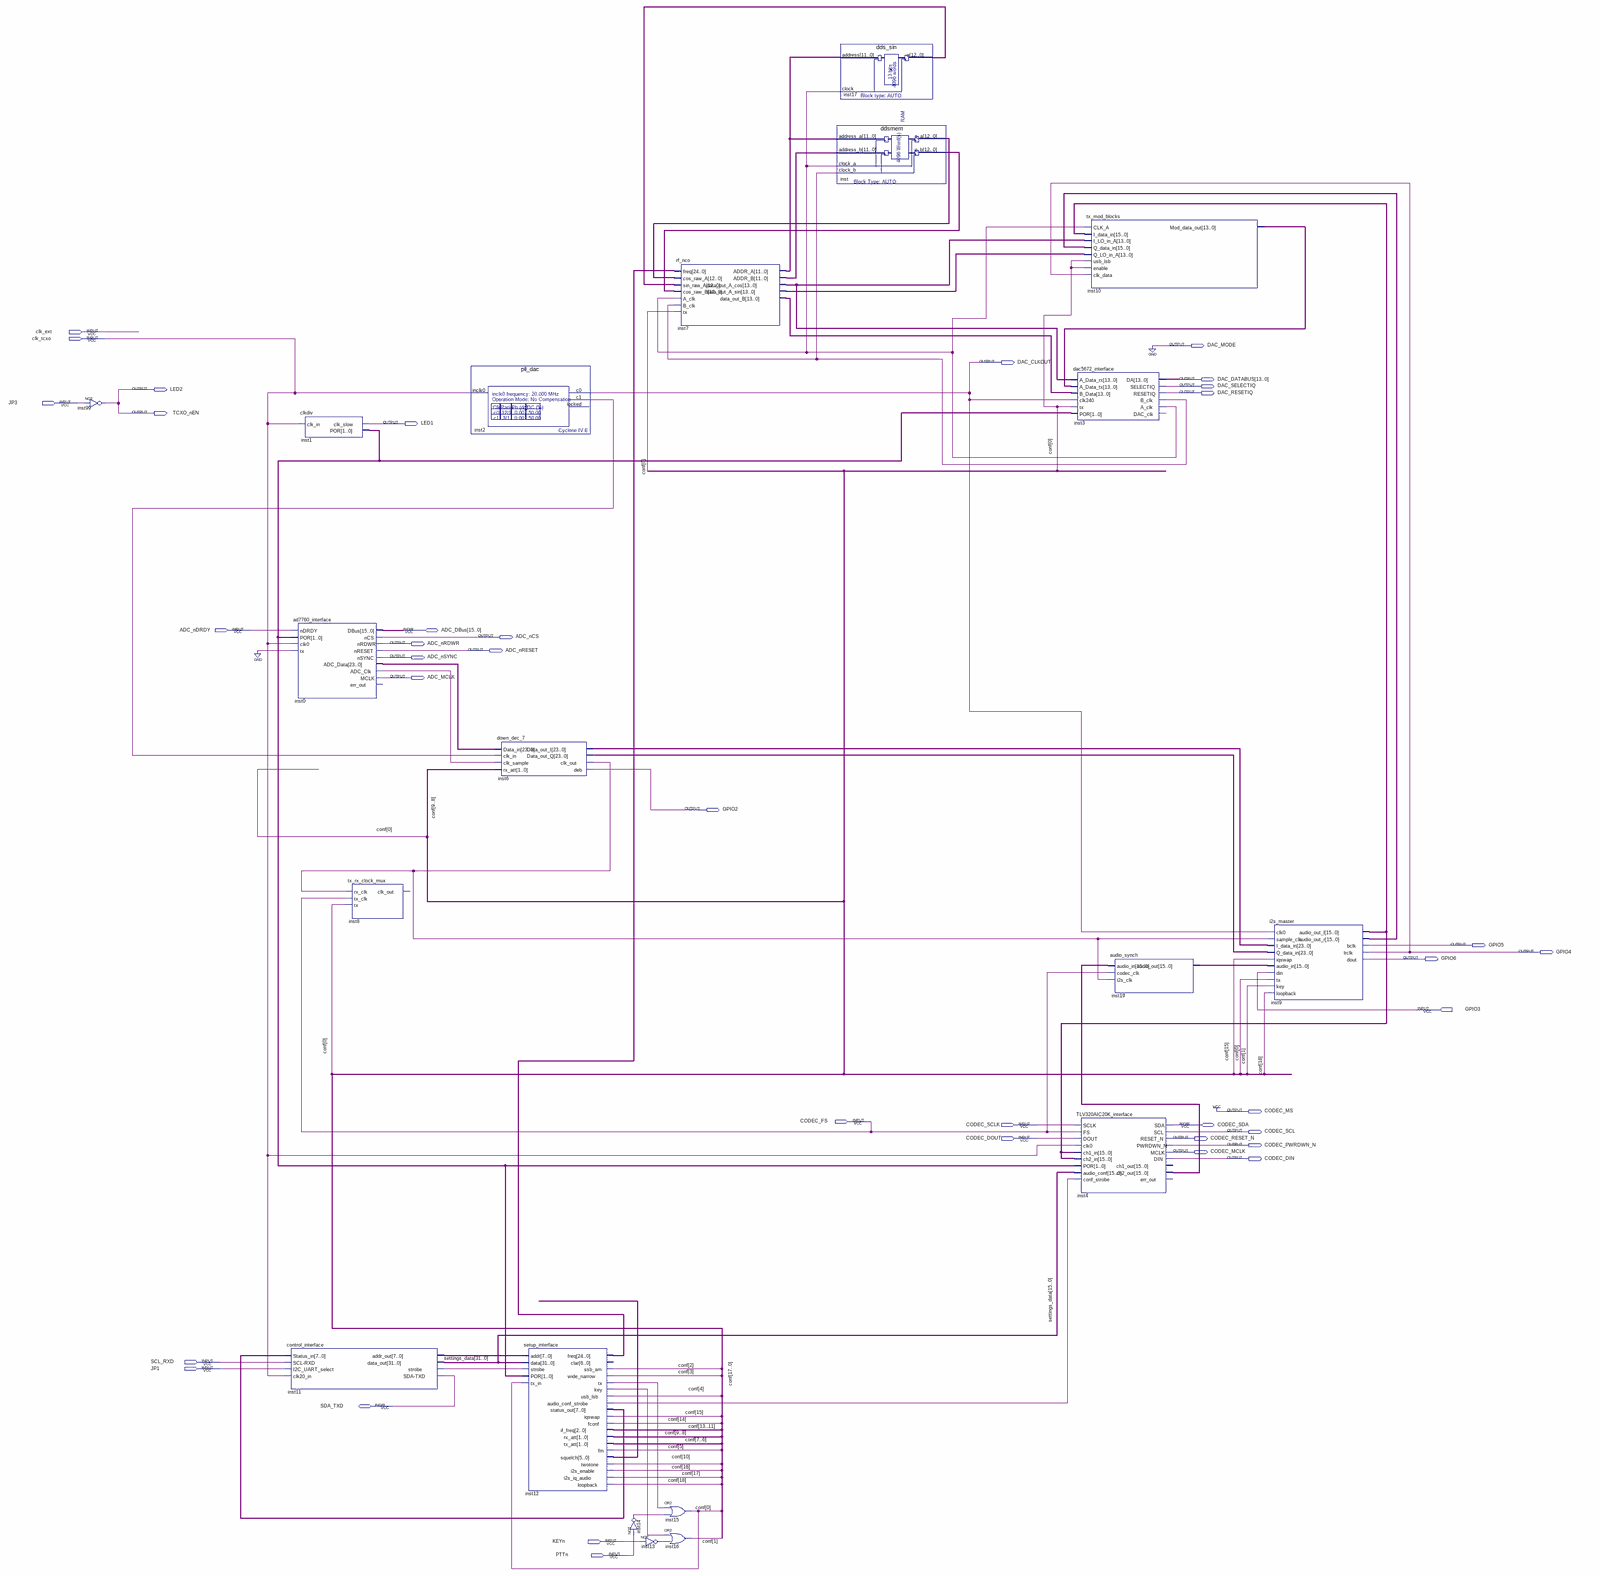
[diagram p0: schematic sheet, whole]
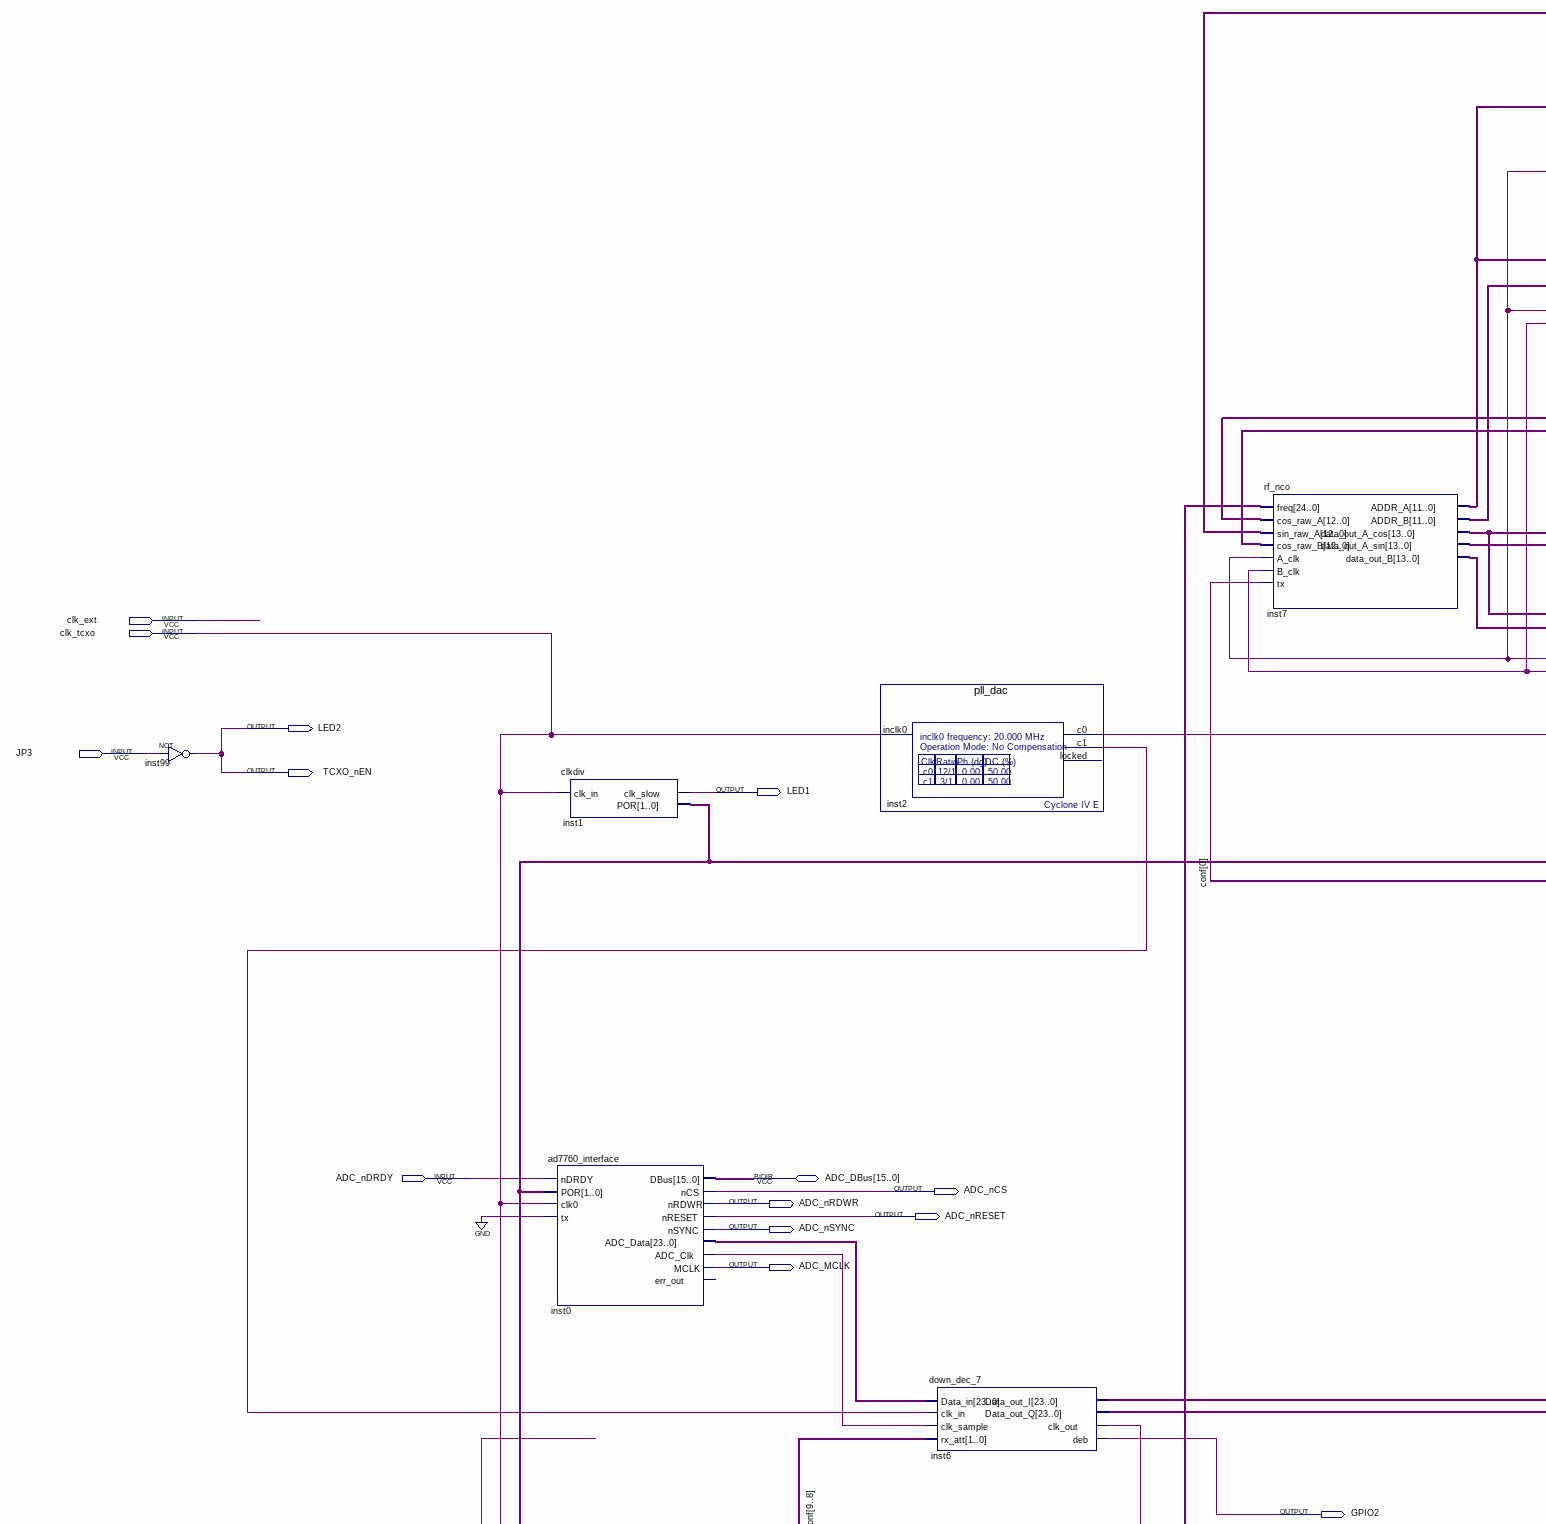
[diagram p1: schematic sheet, upper left part]
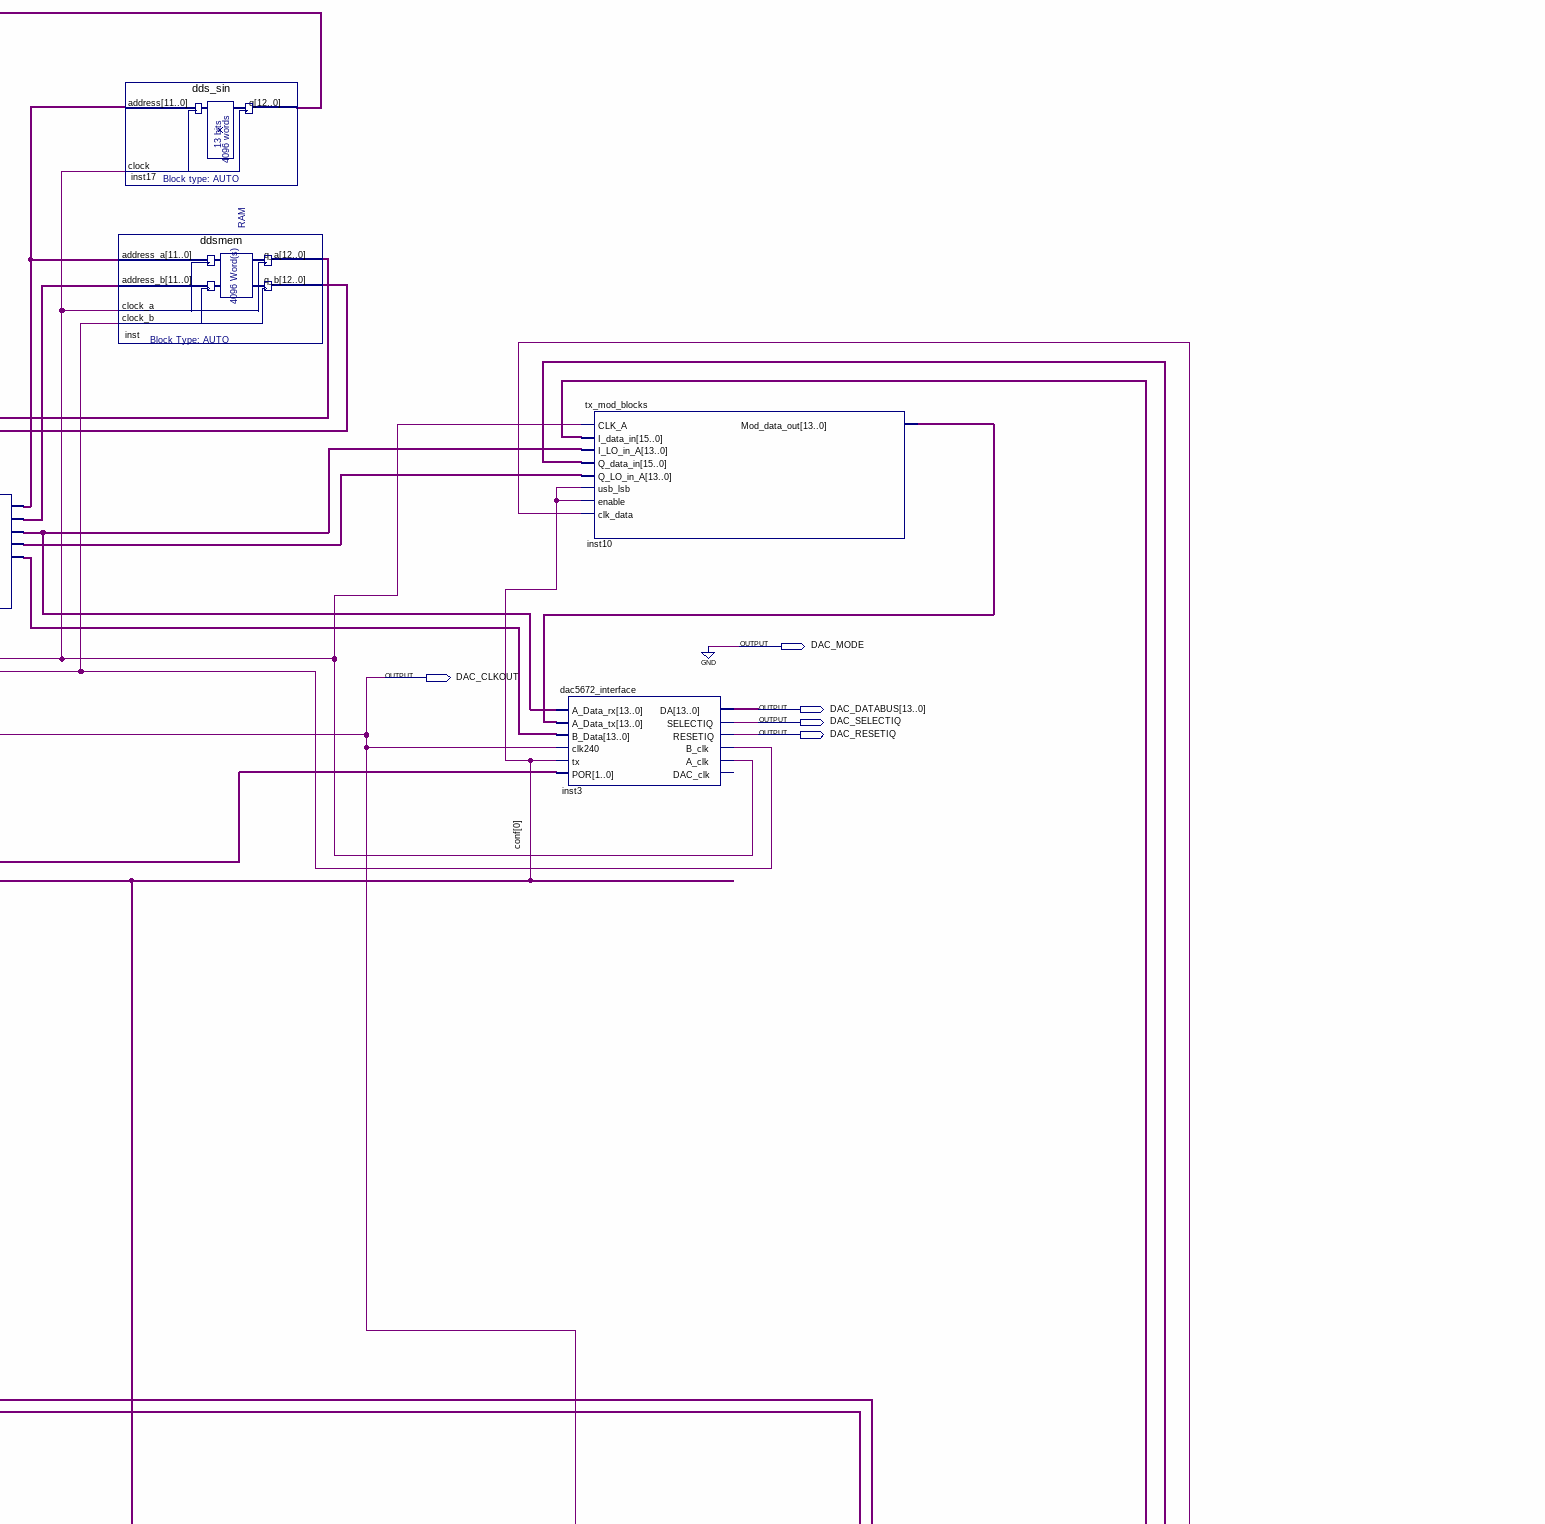
[diagram p2: schematic sheet, upper right part]
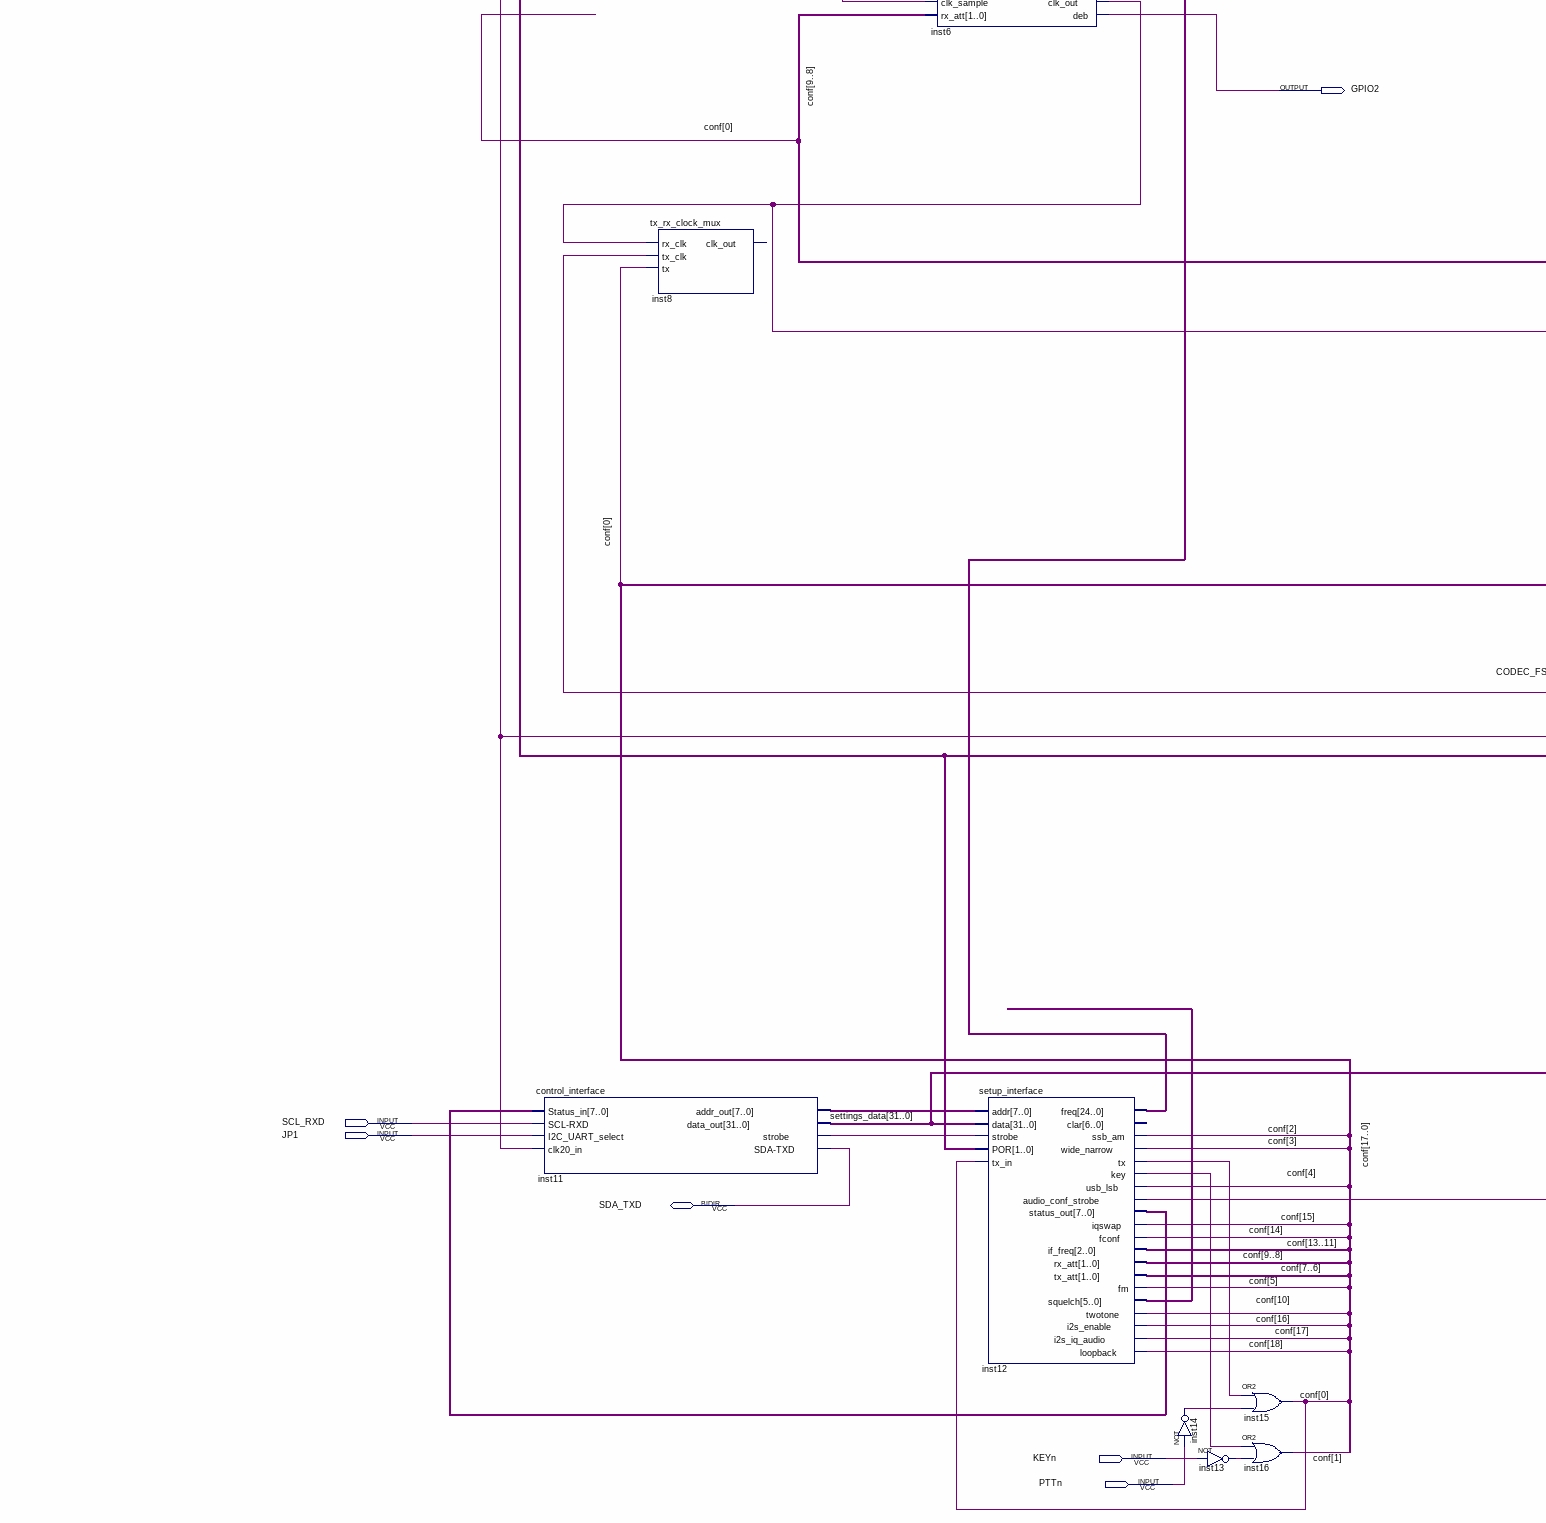
[diagram p3: schematic sheet, lower left part]
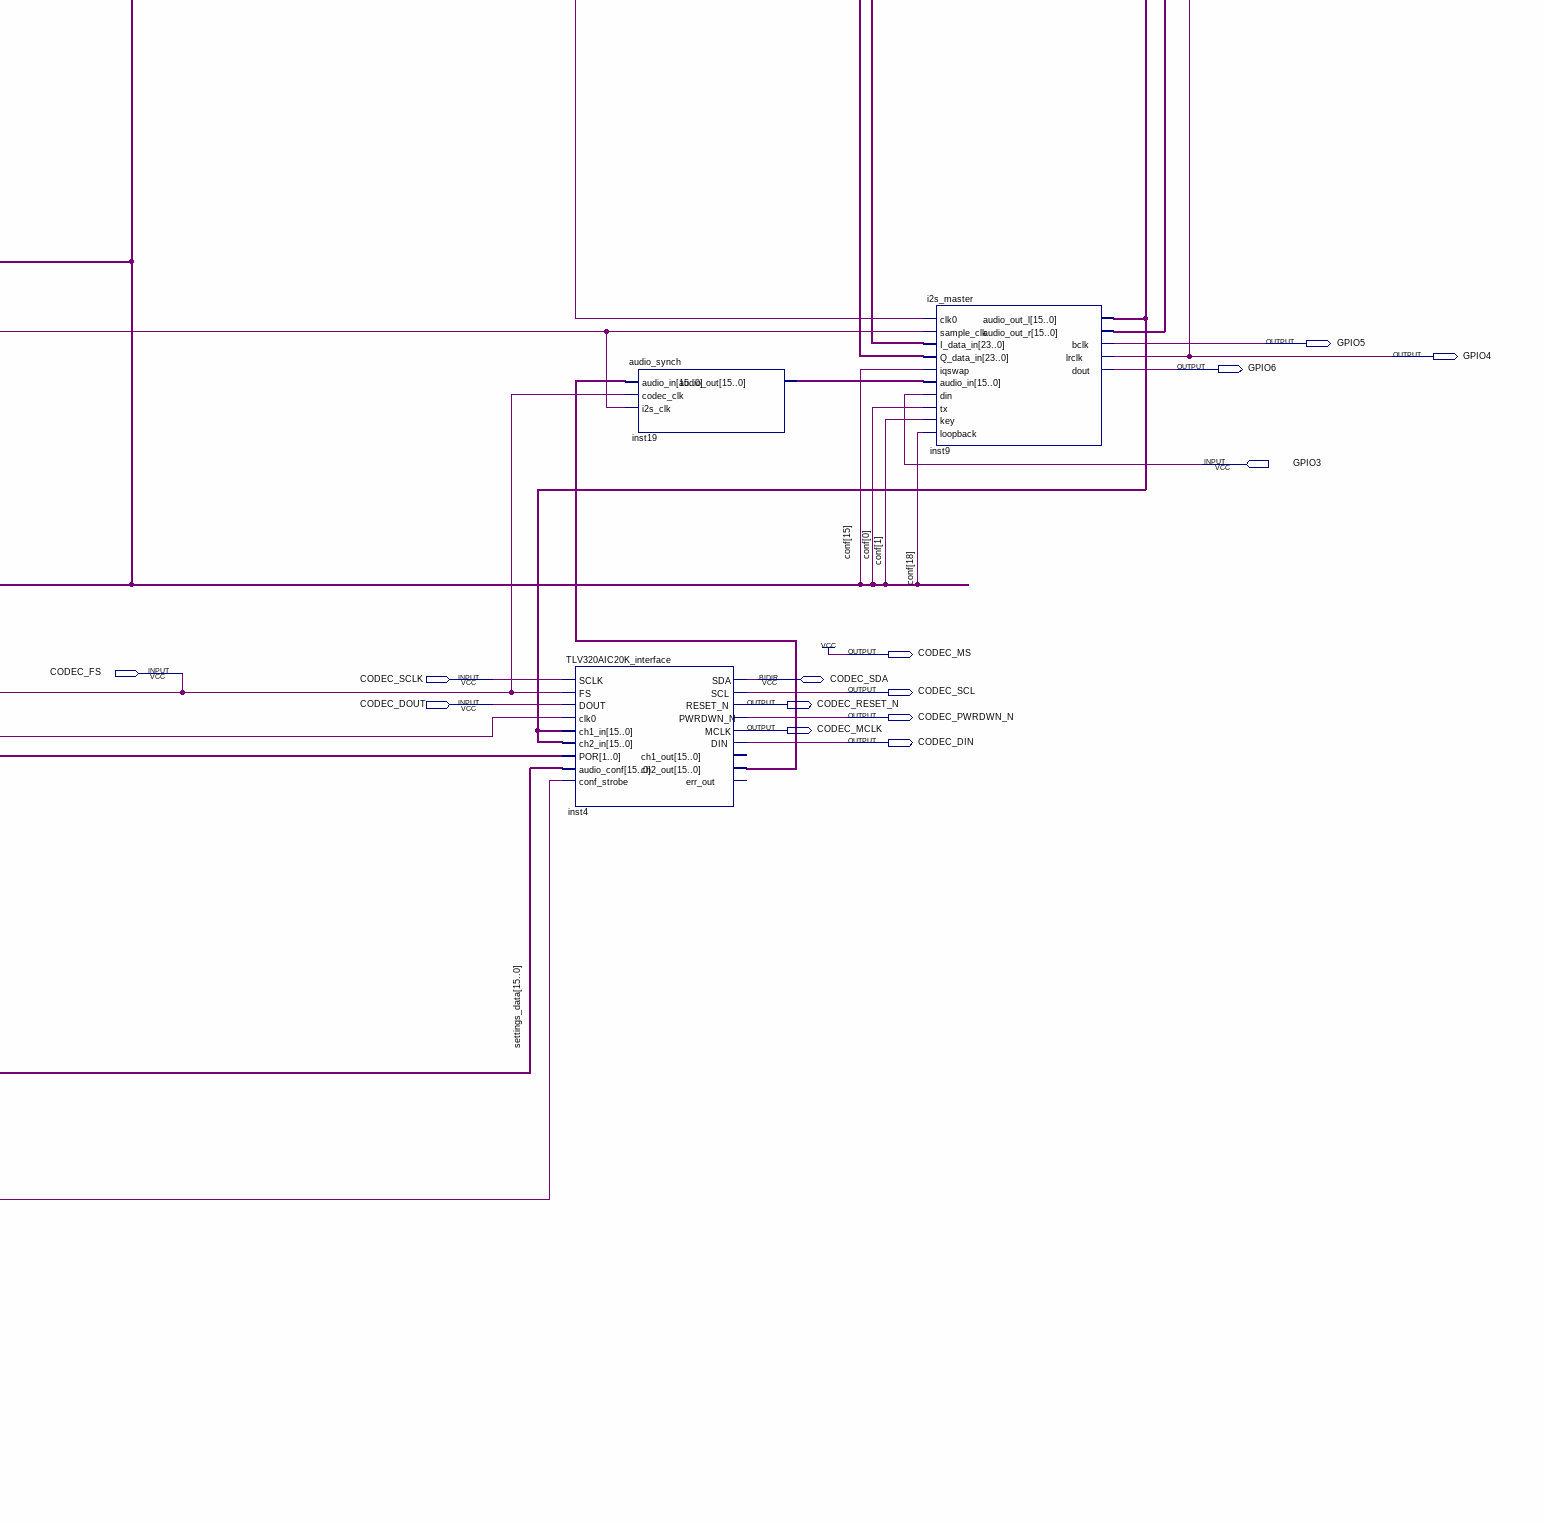
[diagram p4: schematic sheet, lower right part]
// Quartus schematic trx.bdf as structural Verilog: 20 symbols, 38 pins
module trx (
  input  clk_ext,
  input  clk_tcxo,
  input  JP3,
  input  ADC_nDRDY,
  input  GPIO3,
  input  CODEC_FS,
  input  CODEC_SCLK,
  input  CODEC_DOUT,
  input  SCL_RXD,
  input  JP1,
  input  KEYn,
  input  PTTn,
  inout  [15:0] ADC_DBus,
  inout  CODEC_SDA,
  inout  SDA_TXD,
  output DAC_MODE,
  output DAC_CLKOUT,
  output [13:0] DAC_DATABUS,
  output DAC_SELECTIQ,
  output LED2,
  output DAC_RESETIQ,
  output TCXO_nEN,
  output LED1,
  output ADC_nCS,
  output ADC_nRDWR,
  output ADC_nRESET,
  output ADC_nSYNC,
  output ADC_MCLK,
  output GPIO2,
  output GPIO5,
  output GPIO4,
  output GPIO6,
  output CODEC_MS,
  output CODEC_SCL,
  output CODEC_RESET_N,
  output CODEC_PWRDWN_N,
  output CODEC_MCLK,
  output CODEC_DIN
);

  wire inst0_adc_clk, inst2_c1, inst3_a_clk, inst3_b_clk, inst6_clk_out, inst11_strobe,
       inst12_audio_conf_strobe, inst12_key, inst12_tx, inst13_out, inst14_out;
  wire [1:0] inst1_por;
  wire [5:0] inst12_squelch;
  wire [7:0] inst11_addr_out, inst12_status_out;
  wire [11:0] inst7_addr_a, inst7_addr_b;
  wire [12:0] inst17_q, inst_q_a, inst_q_b;
  wire [13:0] inst7_data_out_a_cos, inst7_data_out_a_sin, inst7_data_out_b, inst10_mod_data_out;
  wire [15:0] inst4_ch2_out, inst9_audio_out_l, inst9_audio_out_r, inst19_audio_out;
  wire [18:0] conf;
  wire [23:0] inst0_adc_data, inst6_data_out_i, inst6_data_out_q;
  wire [24:0] inst12_freq;
  wire [31:0] settings_data;

  not inst99 (LED2, JP3);
  clkdiv inst1 (.clk_in(clk_tcxo), .clk_slow(LED1), .POR(inst1_por));
  ad7760_interface inst0 (
    .nDRDY(ADC_nDRDY), .POR(inst1_por), .clk0(clk_tcxo), .tx(1'b0), .nCS(ADC_nCS), .nRDWR(ADC_nRDWR),
    .nRESET(ADC_nRESET), .nSYNC(ADC_nSYNC), .ADC_Data(inst0_adc_data), .ADC_Clk(inst0_adc_clk),
    .MCLK(ADC_MCLK), .DBus(ADC_DBus));  // open: err_out
  control_interface inst11 (
    .Status_in(inst12_status_out), .\SCL-RXD (SCL_RXD), .I2C_UART_select(JP1), .clk20_in(clk_tcxo),
    .addr_out(inst11_addr_out), .data_out(settings_data), .strobe(inst11_strobe), .\SDA-TXD (SDA_TXD));
  tx_rx_clock_mux inst8 (.rx_clk(inst6_clk_out), .tx_clk(CODEC_FS), .tx(conf[0]));  // open: clk_out
  pll_dac inst2 (.inclk0(clk_tcxo), .c0(DAC_CLKOUT), .c1(inst2_c1));  // open: locked
  down_dec_7 inst6 (
    .Data_in(inst0_adc_data), .clk_in(inst2_c1), .clk_sample(inst0_adc_clk), .rx_att(conf[9:8]),
    .Data_out_I(inst6_data_out_i), .Data_out_Q(inst6_data_out_q), .clk_out(inst6_clk_out), .deb(GPIO2));
  setup_interface inst12 (
    .addr(inst11_addr_out), .data(settings_data), .strobe(inst11_strobe), .POR(inst1_por), .tx_in(conf[0]),
    .freq(inst12_freq), .ssb_am(conf[2]), .wide_narrow(conf[3]), .tx(inst12_tx), .key(inst12_key),
    .usb_lsb(conf[4]), .audio_conf_strobe(inst12_audio_conf_strobe), .status_out(inst12_status_out),
    .iqswap(conf[15]), .fconf(conf[14]), .if_freq(conf[13:11]), .rx_att(conf[9:8]), .tx_att(conf[7:6]),
    .fm(conf[5]), .squelch(inst12_squelch), .twotone(conf[10]), .i2s_enable(conf[16]),
    .i2s_iq_audio(conf[17]), .loopback(conf[18]));  // open: clar
  not inst14 (inst14_out, PTTn);
  not inst13 (inst13_out, KEYn);
  rf_nco inst7 (
    .freq(inst12_freq), .cos_raw_A(inst_q_a), .sin_raw_A(inst17_q), .cos_raw_B(inst_q_b),
    .A_clk(inst3_a_clk), .B_clk(inst3_b_clk), .tx(conf[0]), .ADDR_A(inst7_addr_a), .ADDR_B(inst7_addr_b),
    .data_out_A_cos(inst7_data_out_a_cos), .data_out_A_sin(inst7_data_out_a_sin),
    .data_out_B(inst7_data_out_b));
  or inst15 (conf[0], inst12_tx, inst14_out);
  or inst16 (conf[1], inst12_key, inst13_out);
  dds_sin inst17 (.address(inst7_addr_a), .clock(inst3_a_clk), .q(inst17_q));
  ddsmem inst (
    .address_a(inst7_addr_a), .address_b(inst7_addr_b), .clock_a(inst3_a_clk), .clock_b(inst3_b_clk),
    .q_a(inst_q_a), .q_b(inst_q_b));
  tx_mod_blocks inst10 (
    .CLK_A(inst3_a_clk), .I_data_in(inst9_audio_out_l), .I_LO_in_A(inst7_data_out_a_cos),
    .Q_data_in(inst9_audio_out_r), .Q_LO_in_A(inst7_data_out_a_sin), .usb_lsb(conf[0]), .enable(conf[0]),
    .clk_data(GPIO4), .Mod_data_out(inst10_mod_data_out));
  dac5672_interface inst3 (
    .A_Data_rx(inst7_data_out_a_cos), .A_Data_tx(inst10_mod_data_out), .B_Data(inst7_data_out_b),
    .clk240(DAC_CLKOUT), .tx(conf[0]), .POR(inst1_por), .DA(DAC_DATABUS), .SELECTIQ(DAC_SELECTIQ),
    .RESETIQ(DAC_RESETIQ), .B_clk(inst3_b_clk), .A_clk(inst3_a_clk));  // open: DAC_clk
  TLV320AIC20K_interface inst4 (
    .SCLK(CODEC_SCLK), .FS(CODEC_FS), .DOUT(CODEC_DOUT), .clk0(clk_tcxo), .ch1_in(inst9_audio_out_l),
    .ch2_in(inst9_audio_out_l), .POR(inst1_por), .audio_conf(settings_data[15:0]),
    .conf_strobe(inst12_audio_conf_strobe), .SCL(CODEC_SCL), .RESET_N(CODEC_RESET_N),
    .PWRDWN_N(CODEC_PWRDWN_N), .MCLK(CODEC_MCLK), .DIN(CODEC_DIN), .ch2_out(inst4_ch2_out), .SDA(CODEC_SDA));  // open: ch1_out, err_out
  audio_synch inst19 (
    .audio_in(inst4_ch2_out), .codec_clk(CODEC_FS), .i2s_clk(inst6_clk_out), .audio_out(inst19_audio_out));
  i2s_master inst9 (
    .clk0(DAC_CLKOUT), .sample_clk(inst6_clk_out), .I_data_in(inst6_data_out_i),
    .Q_data_in(inst6_data_out_q), .iqswap(conf[15]), .audio_in(inst19_audio_out), .din(GPIO3), .tx(conf[0]),
    .key(conf[1]), .loopback(conf[18]), .audio_out_l(inst9_audio_out_l), .audio_out_r(inst9_audio_out_r),
    .bclk(GPIO5), .lrclk(GPIO4), .dout(GPIO6));

  assign CODEC_MS = 1'b1;
  assign DAC_MODE = 1'b0;
  assign TCXO_nEN = LED2;
endmodule
